# EAGLE design Honda Fit CAN Gateway (EAGLE 7.4.0)

## Sheet 1 of 2
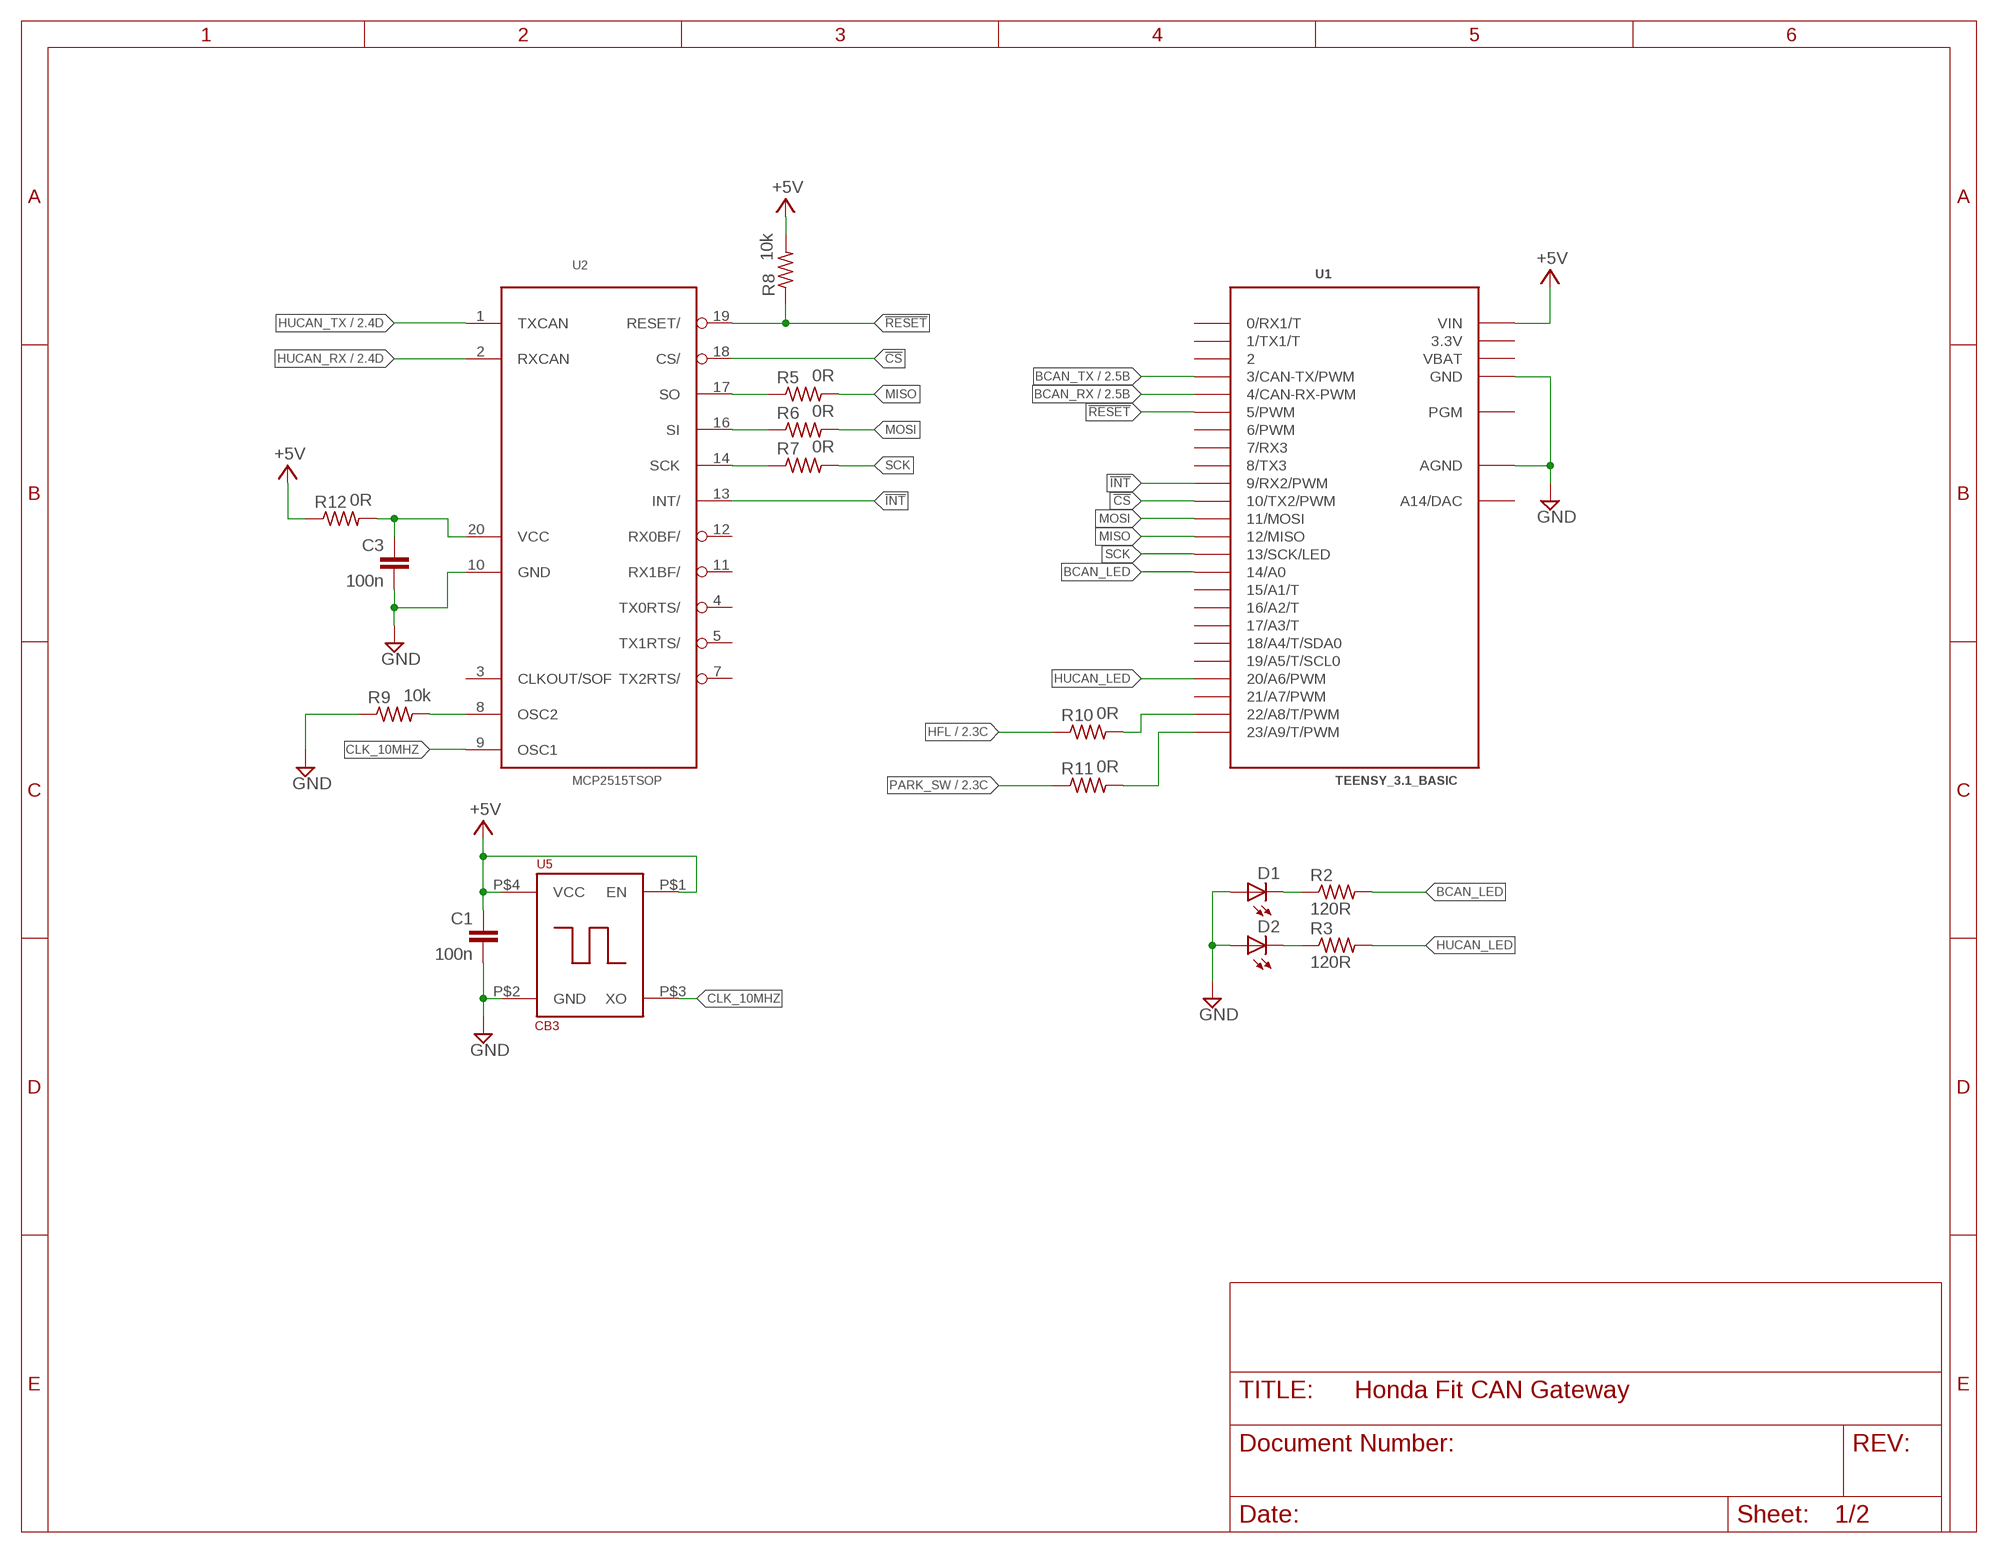
[diagram p0: schematic, sheet 1]

### Parts
C1  100n  C-EUC0603  [C0603]
C3  100n  C-EUC0603  [C0603]
D1  LEDCHIP-LED0805  [CHIP-LED0805]
D2  LEDCHIP-LED0805  [CHIP-LED0805]
R2  120R  R-US_R0805  [R0805]
R3  120R  R-US_R0805  [R0805]
R5  0R  R-US_R0805  [R0805]
R6  0R  R-US_R0805  [R0805]
R7  0R  R-US_R0805  [R0805]
R8  10k  R-US_R0805  [R0805]
R9  10k  R-US_R0805  [R0805]
R10  0R  R-US_R0805  [R0805]
R11  0R  R-US_R0805  [R0805]
R12  0R  R-US_R0805  [R0805]
U1  TEENSY_3.1_BASIC  [TEENSY_3.1_BASIC]
U2  MCP2515TSOP  [TSSOP20]
U5  CB3  [4-SMD]

### Nets
!CS: U1.10(10/TX2/PWM) U2.18(CS/)
!INT: U1.9(9/RX2/PWM) U2.13(INT/)
!RESET: R8.1 U1.5(5/PWM) U2.19(RESET/)
+5V: C1.1 R8.2 R12.1 U1.VIN U5.P$1(EN) U5.P$4(VCC) ; also sheet 2
BCAN_LED: R2.2 U1.14/A0
BCAN_RX: U1.4(4/CAN-RX-PWM) ; also sheet 2
BCAN_TX: U1.3(3/CAN-TX/PWM) ; also sheet 2
CLK_10MHZ: U2.9(OSC1) U5.P$3(XO)
GND: C1.2 C3.2 D1.A D2.A R9.1 U1.AGND U1.GND U1.GND1(GND) U2.10(GND) U5.P$2(GND) ; also sheet 2
HFL: R10.1 ; also sheet 2
HUCAN_LED: R3.2 U1.20/A6(20/A6/PWM)
HUCAN_RX: U2.2(RXCAN) ; also sheet 2
HUCAN_TX: U2.1(TXCAN) ; also sheet 2
MISO: R5.2 U1.12(12/MISO)
MOSI: R6.2 U1.11(11/MOSI)
N$1: R9.2 U2.8(OSC2)
N$2: R10.2 U1.22/A8(22/A8/T/PWM)
N$3: R11.2 U1.23/A9(23/A9/T/PWM)
N$4: D1.C R2.1
N$5: D2.C R3.1
N$6: R5.1 U2.17(SO)
N$7: R6.1 U2.16(SI)
N$8: R7.1 U2.14(SCK)
N$9: C3.1 R12.2 U2.20(VCC)
PARK_SW: R11.1 ; also sheet 2
SCK: R7.2 U1.13(13/SCK/LED)
Unconnected: U1.0(0/RX1/T) U1.1(1/TX1/T) U1.2 U1.6(6/PWM) U1.7(7/RX3) U1.8(8/TX3) U1.15/A1(15/A1/T) U1.16/A2(16/A2/T) U1.17/A3(17/A3/T) U1.18/A4(18/A4/T/SDA0) U1.19/A5(19/A5/T/SCL0) U1.21/A7(21/A7/PWM) U1.A14(A14/DAC) U1.PGM U2.3(CLKOUT/SOF) U2.4(TX0RTS/) U2.5(TX1RTS/) U2.7(TX2RTS/) U2.11(RX1BF/) U2.12(RX0BF/)

## Sheet 2 of 2
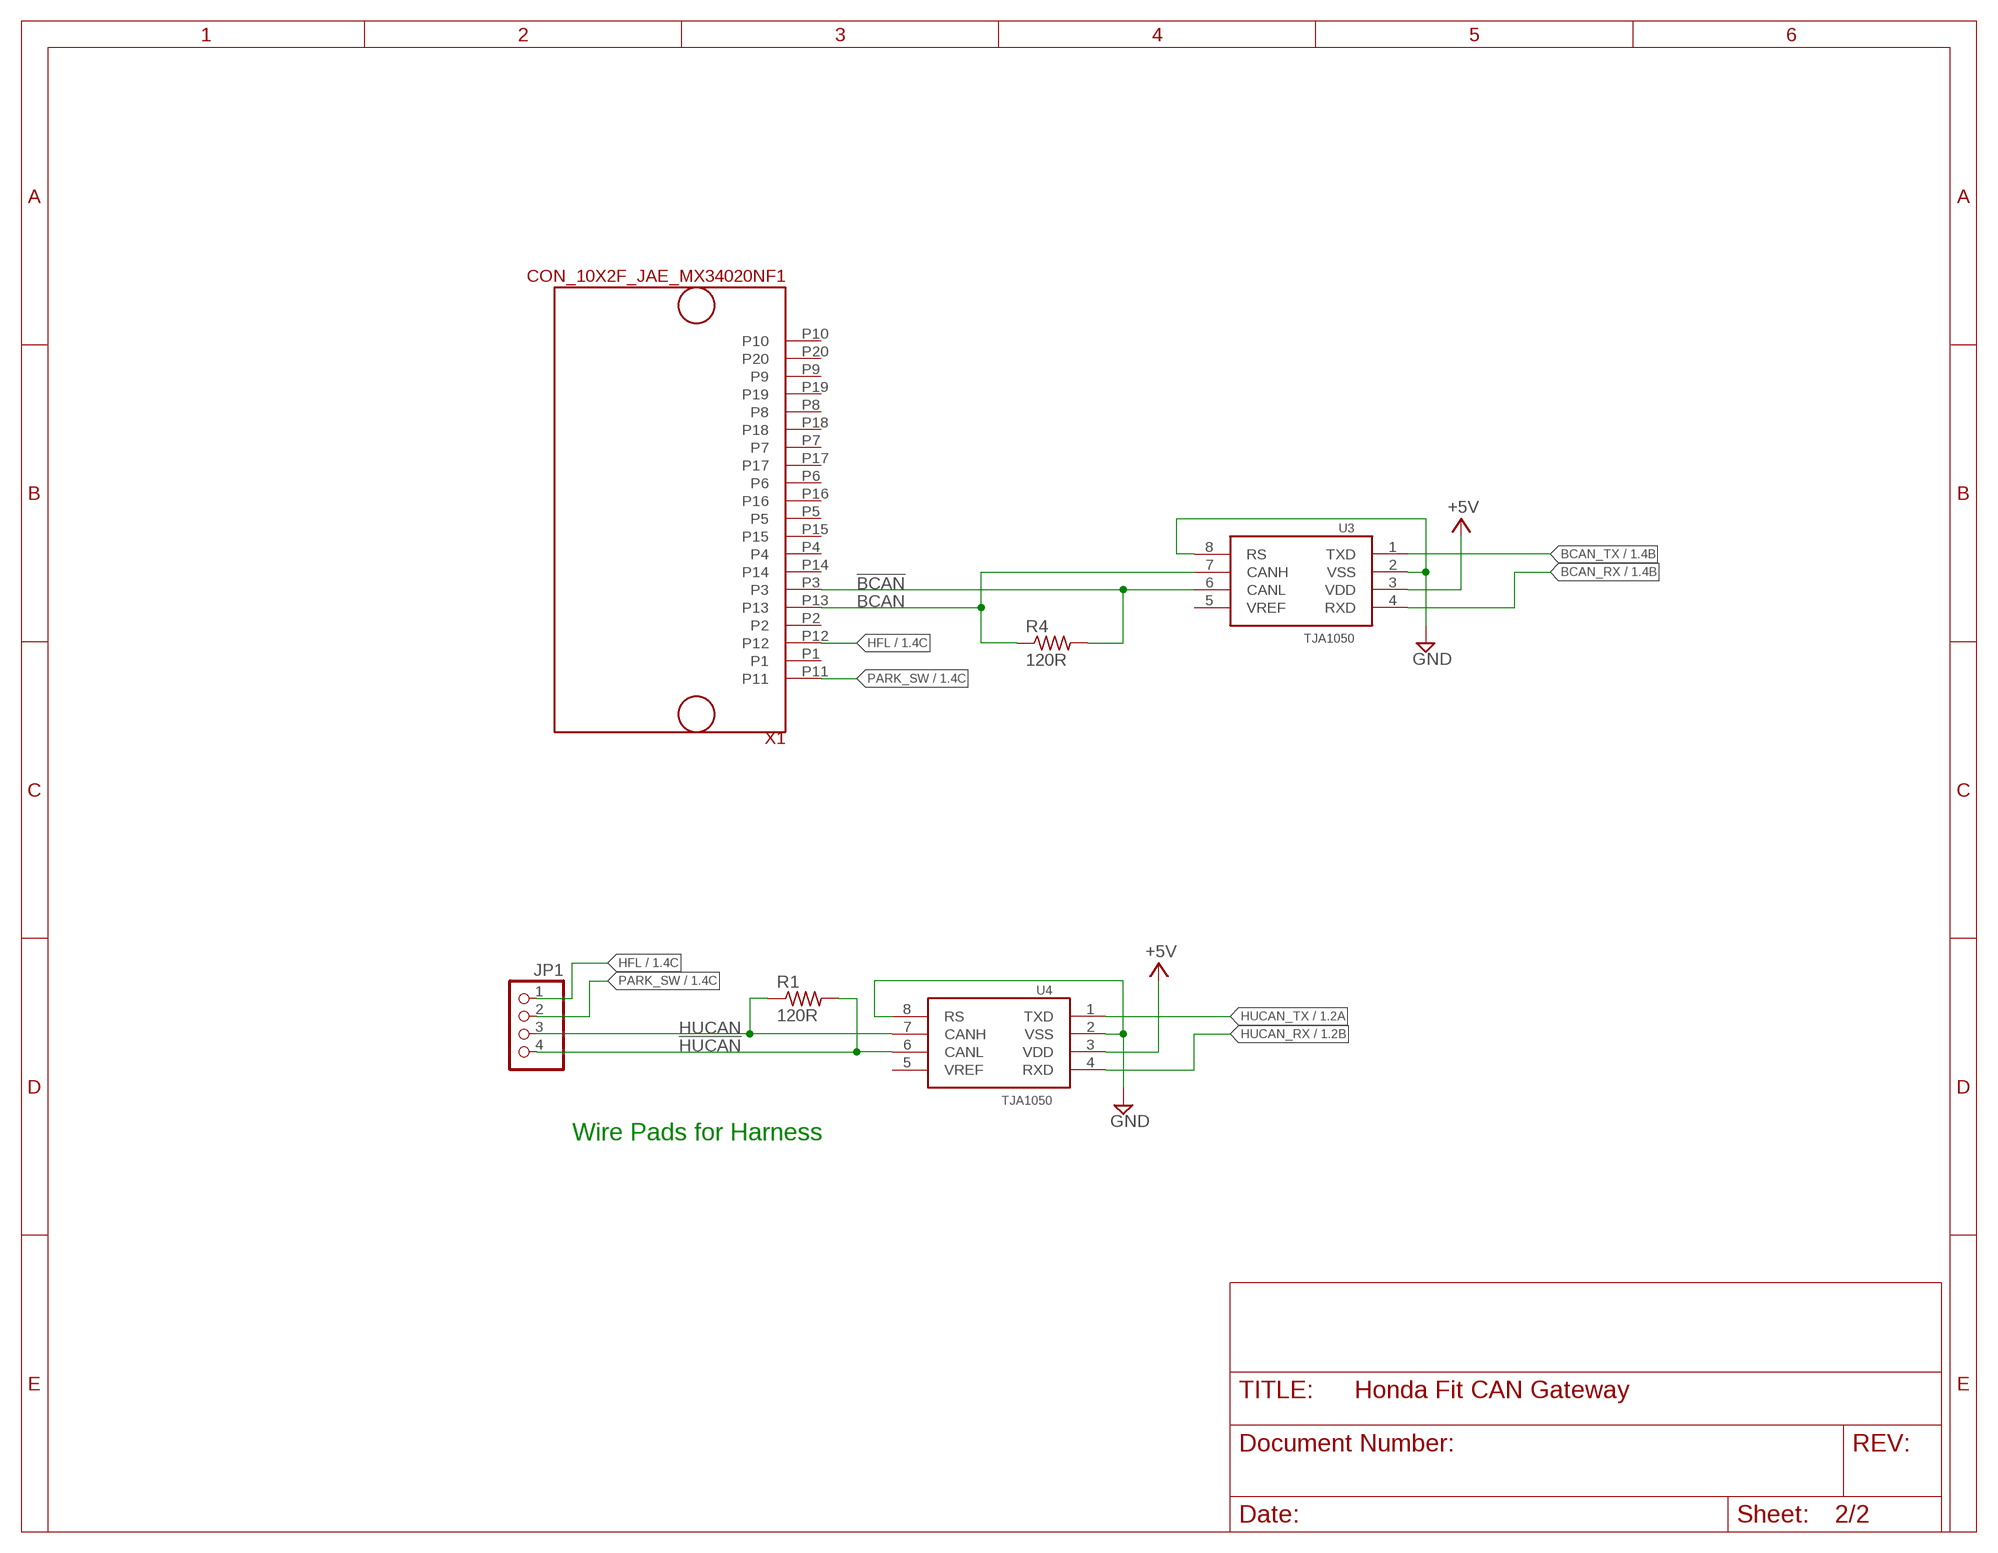
[diagram p1: schematic, sheet 2]

### Parts
JP1  PINHD-1X4  [1X04]
R1  120R  R-US_R0805  [R0805]
R4  120R  R-US_R0805  [R0805]
U3  TJA1050  [SO08]
U4  TJA1050  [SO08]
X1  CON_10X2F_JAE_MX34020NF1  [CON_10X2_JAE_MX34020NF1]

### Nets
!BCAN: R4.2 U3.6(CANL) X1.P3
!HUCAN: JP1.4 R1.2 U4.6(CANL)
+5V: U3.3(VDD) U4.3(VDD) ; also sheet 1
BCAN: R4.1 U3.7(CANH) X1.P13
BCAN_RX: U3.4(RXD) ; also sheet 1
BCAN_TX: U3.1(TXD) ; also sheet 1
GND: U3.2(VSS) U3.8(RS) U4.2(VSS) U4.8(RS) ; also sheet 1
HFL: JP1.1 X1.P12 ; also sheet 1
HUCAN: JP1.3 R1.1 U4.7(CANH)
HUCAN_RX: U4.4(RXD) ; also sheet 1
HUCAN_TX: U4.1(TXD) ; also sheet 1
PARK_SW: JP1.2 X1.P11 ; also sheet 1
Unconnected: U3.5(VREF) U4.5(VREF) X1.P1 X1.P2 X1.P4 X1.P5 X1.P6 X1.P7 X1.P8 X1.P9 X1.P10 X1.P14 X1.P15 X1.P16 X1.P17 X1.P18 X1.P19 X1.P20

### Notes on the sheet
- Wire Pads for Harness

## Power pins joined to a net without a drawn wire
3.3V: U1.3.3V U1.3.3V1(3.3V)
VBAT: U1.VBAT

## Library data of the parts
C1 C3 = resistor:C-EU: CAPACITOR, European symbol
D1 D2 = led:LED: LED OSRAM: - CHIPLED LG R971, LG N971, LY N971, LG Q971, LY Q971, LO R971, LY R971 LH N974, LH R974 LS Q976, LO Q976, LY Q976 LO Q996 - Hyper CHIPLED LW Q18S LB Q993, LB Q99A, LB R99A - SideLED LS A670, LO A670, LY A670, LG A670, LP A670 LB A673, LV A673, LT A673, LW A673 LH A674 LY A675 LS A676, LA A676, LO A676, LY A676, LW A676 LS A679, LY A679, LG A679 - Hyper Micro SIDELED® LS Y876, LA Y876, LO Y876, LY Y876 LT Y87S - SmartLED LW L88C, LW L88S LB L89C, LB L89S, LG L890 LS L89K, LO L89K, LY L89K LS L896, LA L896, LO L896, LY L896 - TOPLED LS T670, LO T670, LY T670, LG T670, LP T670 LSG T670, LSP T670, LSY T670, LOP T670, LYG T670 LG T671, LOG T671, LSG T671 LB T673, LV T673, LT T673, LW T673 LH T674 LS T676, LA T676, LO T676, LY T676, LB T676, LH T676, LSB T676, LW T676 LB T67C, LV T67C, LT T67C, LS T67K, LO T67K, LY T67K, LW E67C LS E67B, LA E67B, LO E67B, LY E67B, LB E67C, LV E67C, LT E67C LW T67C LS T679, LY T679, LG T679 LS T770, LO T770, LY T770, LG T770, LP T770 LB T773, LV T773, LT T773, LW T773 LH T774 LS E675, LA E675, LY E675, LS T675 LS T776, LA T776, LO T776, LY T776, LB T776 LHGB T686 LT T68C, LB T68C - Hyper Mini TOPLED® LB M676 - Mini TOPLED Santana® LG M470 LS M47K, LO M47K, LY M47K Source: http://www.osram.convergy.de LUXEON: - LUMILED® LXK2-PW12-R00, LXK2-PW12-S00, LXK2-PW14-U00, LXK2-PW14-V00 LXK2-PM12-R00, LXK2-PM12-S00, LXK2-PM14-U00 LXK2-PE12-Q00, LXK2-PE12-R00, LXK2-PE12-S00, LXK2-PE14-T00, LXK2-PE14-U00 LXK2-PB12-K00, LXK2-PB12-L00, LXK2-PB12-M00, LXK2-PB14-N00, LXK2-PB14-P00, LXK2-PB14-Q00 LXK2-PR12-L00, LXK2-PR12-M00, LXK2-PR14-Q00, LXK2-PR14-R00 LXK2-PD12-Q00, LXK2-PD12-R00, LXK2-PD12-S00 LXK2-PH12-R00, LXK2-PH12-S00 LXK2-PL12-P00, LXK2-PL12-Q00, LXK2-PL12-R00 Source: www.luxeon.com KINGBRIGHT: KA-3528ASYC Source: www.kingbright.com
JP1 = pinhead:PINHD-1X4: PIN HEADER
R1-R12 = resistor:R-US_: RESISTOR, American symbol
U1 = Teensy_3_Series_Board_v1.0:TEENSY_3.1_BASIC: Footprint for Teensy 3.1 board using all pin connections on the outer perimeter
U2 = MCP2515_MT:MCP2515*: MCP2515 Standalone CAN-Controller by Microchip Eagle-Lib. by MartinThomas
U3 U4 = can_driver:TJA1050: High speed CAN transceiver Input levels compatible with 3.3 V and 5 V devices 5V supply
U5 = ductapemaster_custom:CB3: CTS CB3 and CB3LV Series Oscillators Datasheet: http://www.ctscorp.com/wp-content/uploads/2015/11/008-0256-0.pdf
X1 = JAE_MX34:CON_10X2F_JAE_MX34020NF1: JAE MX34 Series Connector, 10x2 Rows

## Board
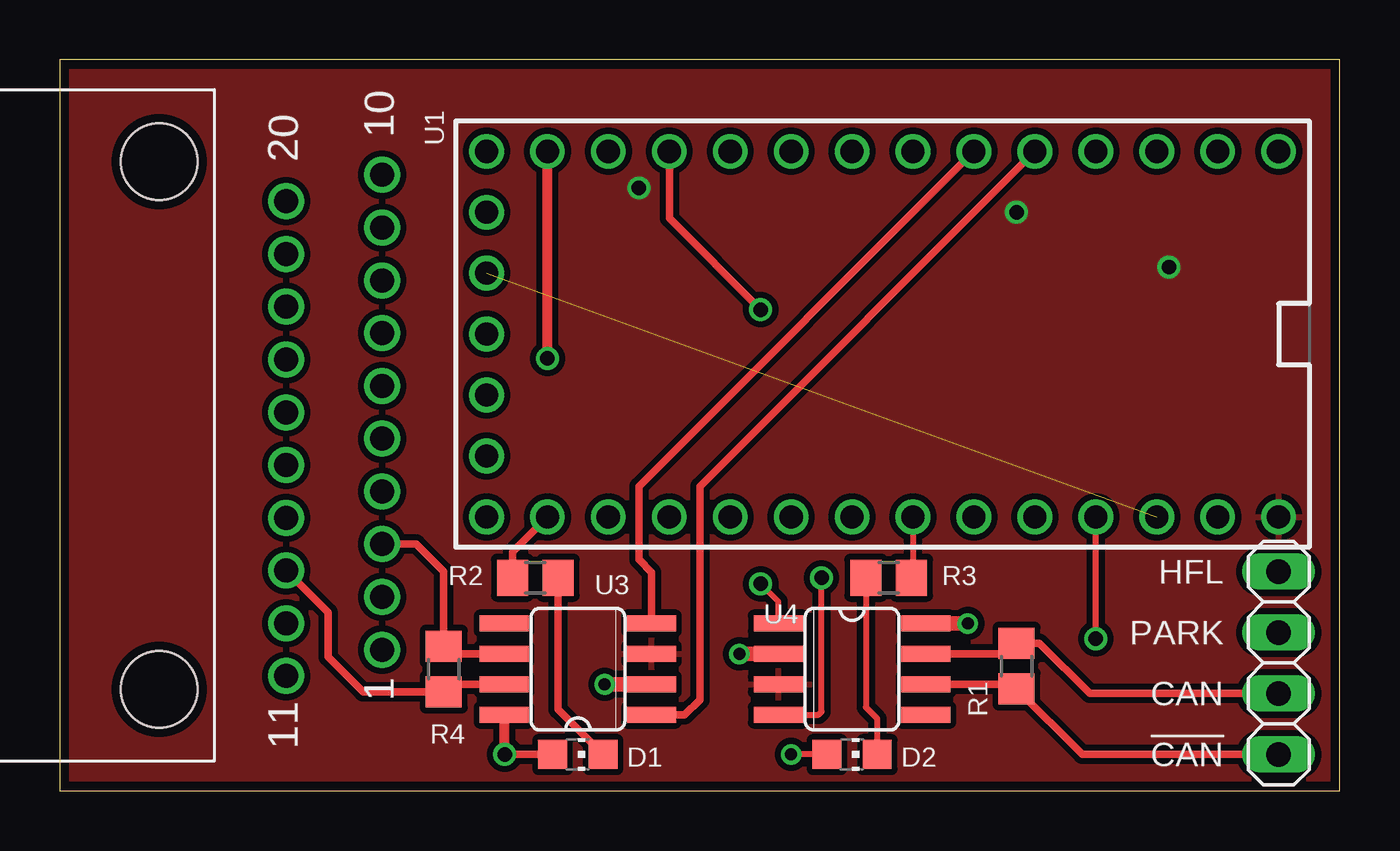
[diagram p2: board, top side]
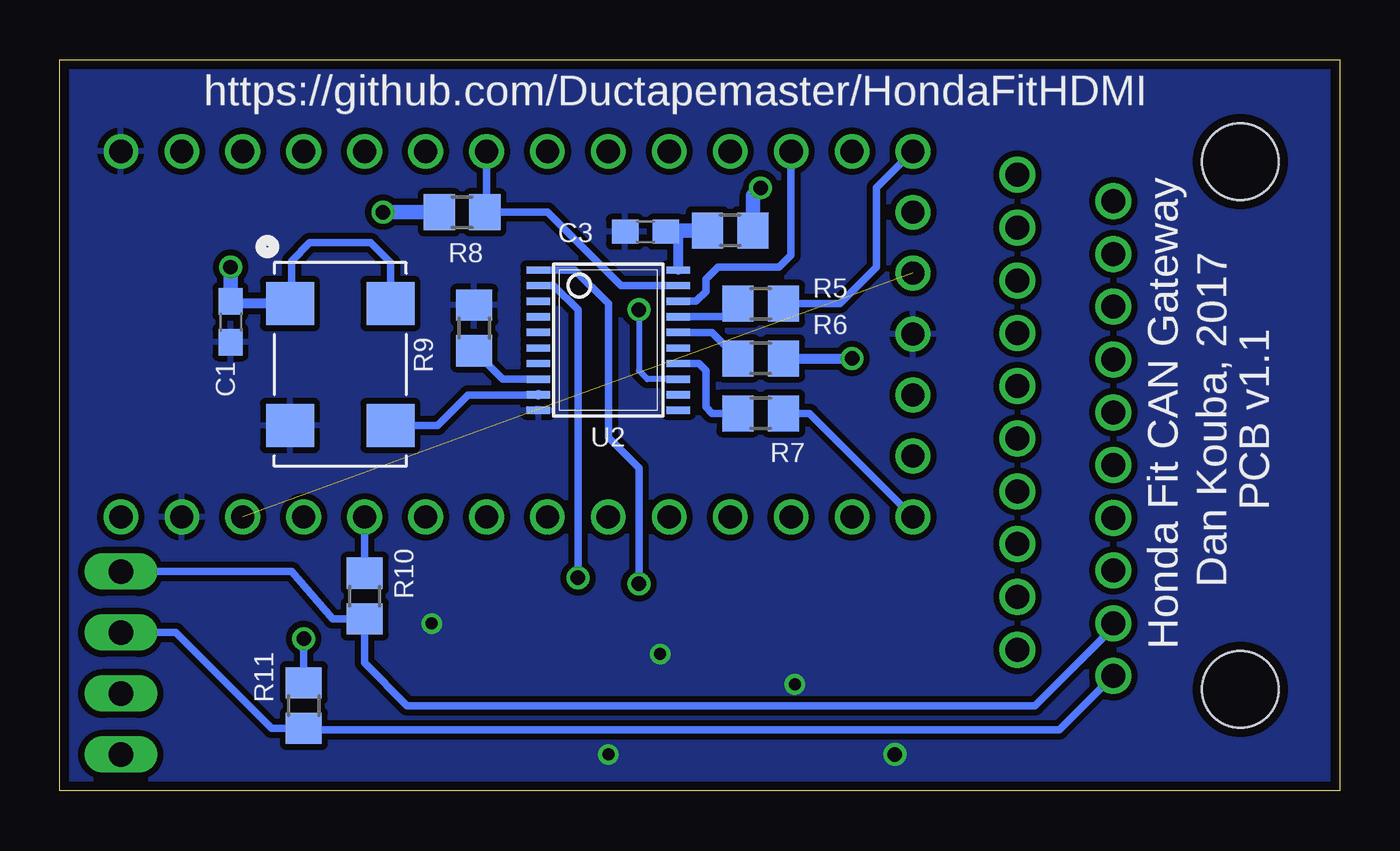
[diagram p3: board, bottom side, seen from below]

Size 53.34 x 30.48 mm. Coordinates in mm from the lower left corner, seen from the top.
Outline: 0,0 53.34,0 53.34,30.48 0,30.48 0,0
Copper layers (1*16): Top 0.0356mm / dielectric 1.5011mm / Bottom 0.0356mm
Design rules "OshParkPCBOrder": minimum track width 6mil, minimum drill 13mil, track to track 6mil, track to pad 6mil, pad to pad 6mil, via to via 6mil, smd to smd 6mil, copper to edge 15mil, drill to drill 6mil, minimum pad ring 7mil, minimum via ring 7mil, stop-mask expansion 3mil, vias tented up to drill 0mil, thermal gap 10mil

### Footprints (pad centres in the part's own frame; a part is rotated, then mirrored left to right if it is on the bottom)
C0603 = smd 1.1 x 1: 1 -0.85,0; 2 0.85,0
CHIP-LED0805 = smd 1.2 x 1.2: A 0,-1.05; C 0,1.05
1X04 = drill 1.016 long: 1 -3.81,0; 2 -1.27,0; 3 1.27,0; 4 3.81,0
R0805 = smd 1.3 x 1.5: 1 -0.95,0; 2 0.95,0
TEENSY_3.1_BASIC = drill 0.965: 0 -7.62,13.97; 1 -7.62,11.43; 2 -7.62,8.89; 3 -7.62,6.35; 3.3V 7.62,11.43; 3.3V1 -2.54,-16.51; 4 -7.62,3.81; 5 -7.62,1.27; 6 -7.62,-1.27; 7 -7.62,-3.81; 8 -7.62,-6.35; 9 -7.62,-8.89; 10 -7.62,-11.43; 11 -7.62,-13.97; 12 -7.62,-16.51; 13 7.62,-16.51; 14/A0 7.62,-13.97; 15/A1 7.62,-11.43; 16/A2 7.62,-8.89; 17/A3 7.62,-6.35; 18/A4 7.62,-3.81; 19/A5 7.62,-1.27; 20/A6 7.62,1.27; 21/A7 7.62,3.81; 22/A8 7.62,6.35; 23/A9 7.62,8.89; A14 5.08,-16.51; AGND 7.62,13.97; GND -7.62,16.51; GND1 0,-16.51; PGM 2.54,-16.51; VBAT -5.08,-16.51; VIN 7.62,16.51
TSSOP20 = smd 0.305 x 0.991: 1 -2.925,-2.918; 2 -2.275,-2.918; 3 -1.625,-2.918; 4 -0.975,-2.918; 5 -0.325,-2.918; 6 0.325,-2.918; 7 0.975,-2.918; 8 1.625,-2.918; 9 2.275,-2.918; 10 2.925,-2.918; 11 2.925,2.918; 12 2.275,2.918; 13 1.625,2.918; 14 0.975,2.918; 15 0.325,2.918; 16 -0.325,2.918; 17 -0.975,2.918; 18 -1.625,2.918; 19 -2.275,2.918; 20 -2.925,2.918
SO08 = smd 0.66 x 2.032: 1 -1.905,-3.073; 2 -0.635,-3.073; 3 0.635,-3.073; 4 1.905,-3.073; 5 1.905,3.073; 6 0.635,3.073; 7 -0.635,3.073; 8 -1.905,3.073
4-SMD = smd 1.803 x 2.007: P$1 -2.54,-2.095; P$2 2.54,-2.095; P$3 2.54,2.095; P$4 -2.54,2.095
CON_10X2_JAE_MX34020NF1 = drill 1: P1 -2,9.35; P2 -2,7.15; P3 -2,4.95; P4 -2,2.75; P5 -2,0.55; P6 -2,-1.65; P7 -2,-3.85; P8 -2,-6.05; P9 -2,-8.25; P10 -2,-10.45; P11 2,10.45; P12 2,8.25; P13 2,6.05; P14 2,3.85; P15 2,1.65; P16 2,-0.55; P17 2,-2.75; P18 2,-4.95; P19 2,-7.15; P20 2,-9.35 | hole 3.2: 7.3,11; 7.3,-11

### Placement (x,y rotation side)
C1  46.23,19.56 270 bottom
C3  28.93,23.32 180 bottom
D1  21.59,1.52 270 top
D2  33.02,1.52 270 top
JP1  50.8,5.33 270 top
R1  39.88,5.21 270 top
R2  19.81,8.89 180 top
R3  34.54,8.89 0 top
R4  16,5.08 90 top
R5  24.13,20.32 0 bottom
R6  24.13,18.03 0 bottom
R7  24.13,15.75 0 bottom
R8  36.58,24.13 180 bottom
R9  36.07,19.3 270 bottom
R10  40.64,8.13 90 bottom
R11  43.18,3.56 90 bottom
R12  25.4,23.37 180 bottom
U1  34.29,19.05 270 top
U2  30.48,18.8 270 bottom
U3  21.59,5.08 90 top
U4  33.02,5.08 270 top
U5  41.66,17.78 270 bottom
X1  11.43,15.24 180 top

### Tracks (layer width: path | path; a pad name or v marks a point on that pad's centre or on a via)
3.3V  (1 unrouted)
!BCAN
  Top 0.254: 16.32,5.71 R4.2
  Top 0.305: X1.P3 14.86,10.29 16,9.14 R4.2 | U3.6 16.32,5.71
!CS
  Bottom 0.305: U2.18 26.82,20.42 26.42,20.83 26.42,21.34 25.91,21.84 23.37,21.84 22.86,22.35 U1.10
!HUCAN
  Top 0.254: 39.69,4.45 R1.2
  Top 0.305: U4.6 39.69,4.45 | JP1.4 42.61,1.52 R1.2
!INT  (via drill 0.6)
  Top 0.305: U1.9 25.4,23.88 v29.21,20.07
  Bottom 0.254: v29.21,20.07 29.21,17.53 28.86,17.17 U2.13
!RESET
  Bottom 0.305: U2.19 29.96,21.07 33.02,24.13 R8.1 | U1.5 35.56,24.2
  Bottom 0.406: 35.56,24.2 R8.1
+5V  (via drill 0.6)
  Bottom 0.305: U5.P$4 39.56,22.04 40.39,22.86 42.93,22.86 43.69,22.1 43.69,20.38
  Bottom 0.406: C1.1 46.14,20.32 U5.P$1 43.69,20.38
  Bottom 0.61: C1.1 v46.23,21.84 | R8.2 v39.88,24.13 | R12.1 24.45,24.83 v24.13,25.15
  pour Top (isolate 0.254): 0,30.48 0,0 53.34,0 53.34,30.48
BCAN
  Top 0.254: 16.32,4.45 R4.1
  Top 0.305: X1.P13 11.18,7.44 11.18,5.59 12.63,4.13 R4.1 | U3.7 16.32,4.45
BCAN_LED
  Top 0.305: U1.14/A0 18.86,9.97 R2.2
BCAN_RX
  Top 0.305: U3.4 24.66,9.12 24.13,9.65 24.13,12.7 U1.4
BCAN_TX
  Top 0.305: U3.1 26.04,3.17 26.67,3.81 26.67,12.7 U1.3
CLK_10MHZ
  Bottom 0.305: U5.P$3 37.59,15.24 36.32,16.51 U2.9
  Bottom 0.406: U2.9
GND  (via drill 0.5, 0.6)
  Top 0.254: D2.A v30.48,1.52
  Top 0.305: v18.54,1.52 D1.A
  Top 0.406: U3.8 18.52,1.55 v18.54,1.52
  Top 0.61: U3.2 v22.71,4.45 | U4.2 v28.32,5.71 | U4.8 v37.85,6.99
  pour Bottom (isolate 0.254): 0,30.48 0,0 53.34,0 53.34,30.48
HFL
  Bottom 0.254: X1.P12 9.43,6.83
  Bottom 0.305: 9.43,6.83 12.7,3.56 38.86,3.56 40.64,5.33 R10.1 41.98,7.18 43.69,9.14 JP1.1
HUCAN
  Top 0.254: 39.44,5.71 R1.1
  Top 0.305: U4.7 39.44,5.71 | R1.1 40.83,6.16 42.93,4.06 JP1.3
HUCAN_LED
  Top 0.254: U1.20/A6 35.56,8.96 R3.2
HUCAN_RX  (via drill 0.6)
  Top 0.254: U4.4 31.62,3.17 31.75,3.3 v31.75,8.89
  Bottom 0.305: U2.2 32.76,21.07 31.75,20.07 v31.75,8.89
HUCAN_TX  (via drill 0.6)
  Top 0.254: U4.1 29.95,7.9 v29.21,8.64
  Bottom 0.305: U2.1 31.88,21.72 30.48,20.32 30.48,14.73 29.21,13.46 v29.21,8.64
MISO
  Bottom 0.305: R5.2 20.83,20.32 19.3,21.84 19.3,25.15 U1.12
MOSI  (via drill 0.6)
  Top 0.406: v20.32,18.03 U1.11
  Bottom 0.406: R6.2 v20.32,18.03
N$1
  Bottom 0.305: U2.8 34.88,17.17 R9.2
N$2
  Bottom 0.305: R10.2 U1.22/A8
N$3  (via drill 0.6)
  Top 0.254: v43.18,6.35 U1.23/A9
  Bottom 0.305: R11.2 v43.18,6.35
N$4
  Top 0.254: 22.61,1.52 22.61,1.56 D1.C
  Top 0.305: R2.1 20.76,3.4 D1.C
N$5
  Top 0.254: R3.1 33.59,3.49 34.07,3.01 D2.C
N$6
  Bottom 0.305: U2.17 25.63,19.77 R5.1
N$7
  Bottom 0.305: U2.16 26.17,19.12 R6.1
N$8
  Bottom 0.305: U2.14 26.71,17.82 26.42,17.53 26.42,16 26.16,15.75 R7.1
N$9
  Bottom 0.406: U2.20 27.56,23.24
  Bottom 0.508: C3.1 28.03,23.37 27.43,23.37 27.56,23.24
  Bottom 0.61: R12.2 27.43,23.37
PARK_SW
  Bottom 0.254: 43.11,2.54 R11.1
  Bottom 0.305: JP1.2 48.51,6.6 44.52,2.61 R11.1 42.99,2.54 11.68,2.54 X1.P11
SCK
  Bottom 0.305: U1.13 22.1,15.75 R7.2

### Text on the board
tNames: HFL | PARK | CAN | !CAN
bNames: https://github.com/Ductapemaster/HondaFitHDMI | Honda Fit CAN Gateway | PCB v1.1 | Dan Kouba, 2017